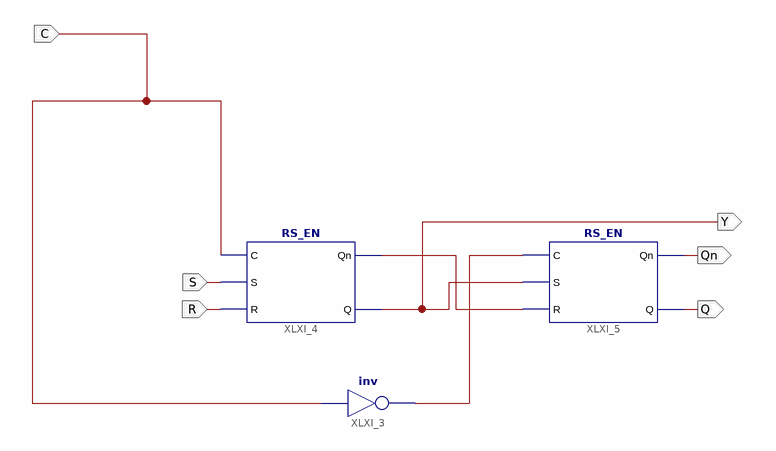
[diagram p0: schematic sheet 1]
// Xilinx ISE schematic RS_Trig.sch (kintex7) as structural Verilog: 3 symbols, 6 ports
module RS_Trig (
  input  C,
  input  S,
  input  R,
  output Y,
  output Qn,
  output Q
);

  wire XLXN_4, Yn;

  not XLXI_3 (XLXN_4, C);
  RS_EN XLXI_4 (.C(C), .S(S), .R(R), .Qn(Yn), .Q(Y));
  RS_EN XLXI_5 (.C(XLXN_4), .S(Y), .R(Yn), .Qn(Qn), .Q(Q));
endmodule
